# EasyEDA schematic 1-Schematic_IoT Board.json
TITLE: Sheet_1; REV: 1.0; Date: 2025-12-24; Sheet: 1/1; Drawn By: nyaigoti; Company: Your Company
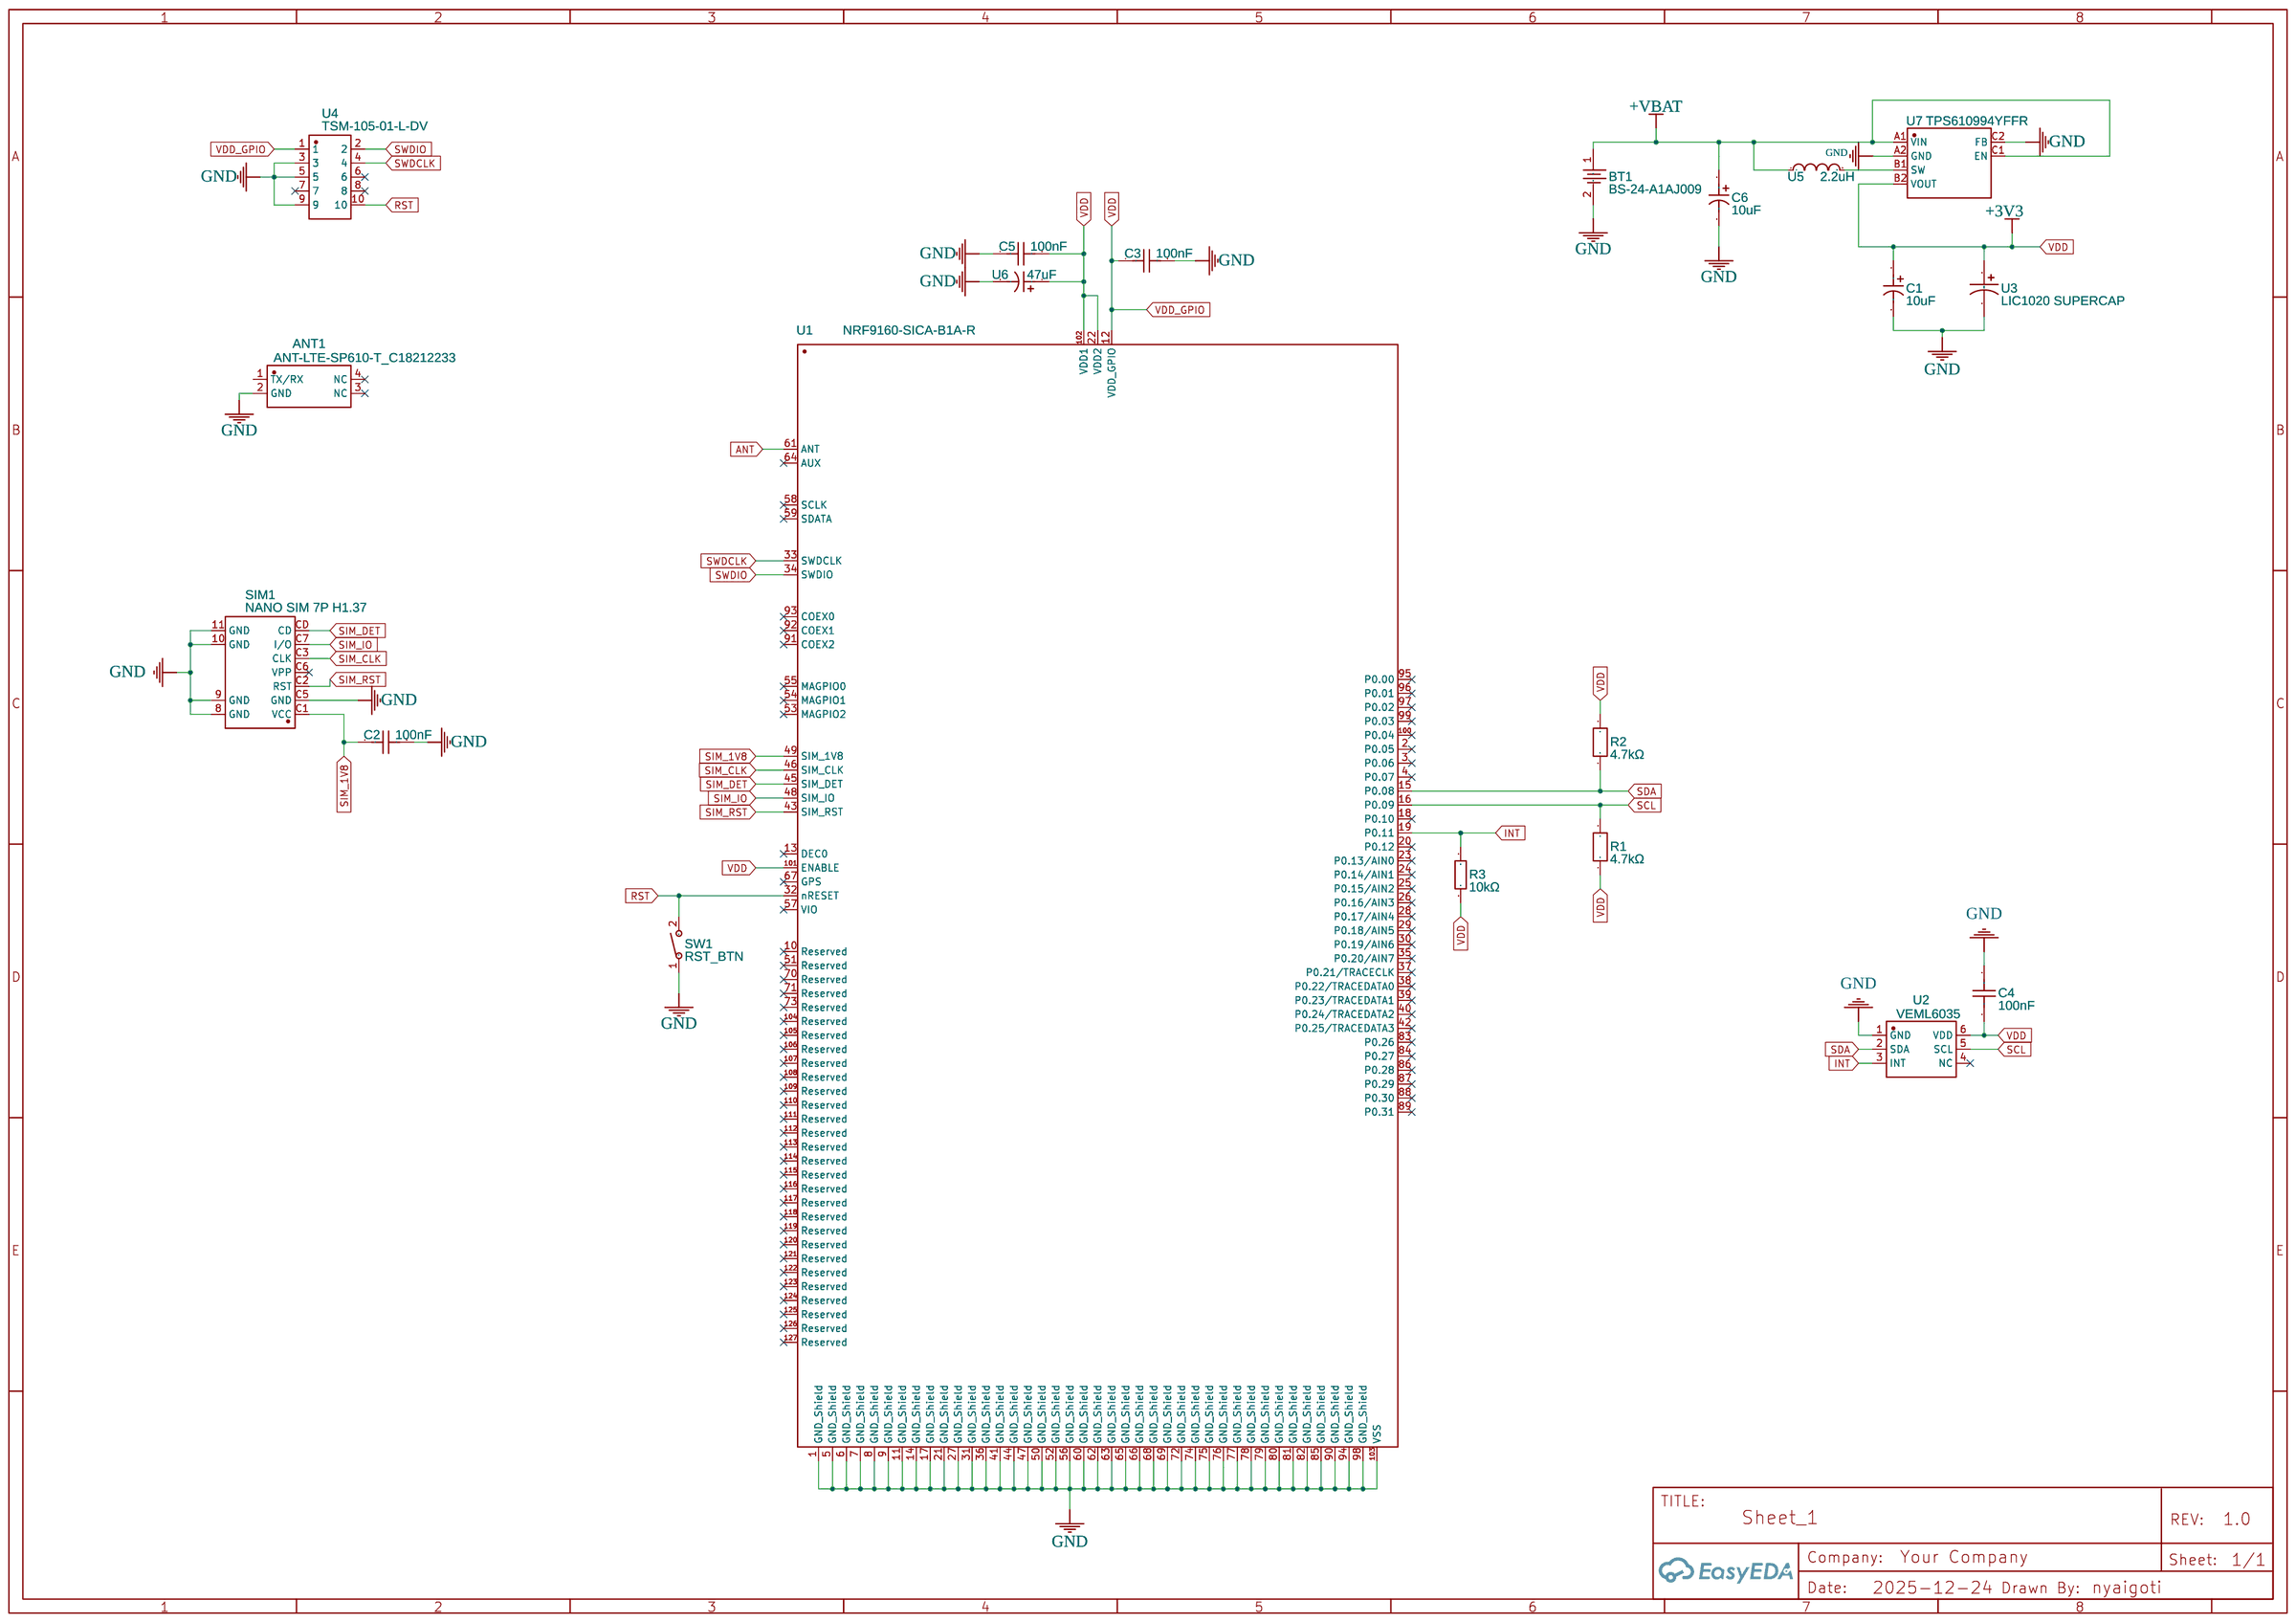
[diagram p0: schematic sheet]

## Parts
ANT1  ANT-LTE-SP610-T_C18212233  [ANT-SMD_ANT-LTE-SP610-T_C18212233]
BT1  BS-24-A1AJ009  [BAT-TH_CR2477-2]
C1  10uF  [CAP-SMD_L3.5-W2.8-FD]
C2  100nF  [C0603]
C3  100nF  [C0603]
C4  100nF  [C0603]
C5  100nF  [C0603]
C6  10uF  [CAP-SMD_L3.5-W2.8-FD]
R1  4.7kΩ  [R0603]
R2  4.7kΩ  [R0603]
R3  10kΩ  [R0603]
SIM1  NANO SIM 7P H1.37  [SIM-SMD_NANO-SIM-7P-H1.37]
SW1  RST_BTN  [KEY-SMD_L4.0-W3.0-LS4.9-1]
U1  NRF9160-SICA-B1A-R  [LGA-127_L16.0-W10.5-P0.50-TL_NRF9160]
U2  VEML6035  [SMD-6_L2.0-W2.0-P0.65-BL]
U3  LIC1020 SUPERCAP  [CAP-TH_BD10.0-P5.00-D1.0-FD]
U4  TSM-105-01-L-DV  [CONN-SMD_10P-P2.54_TSM-105-01-F-DV]
U5  2.2uH  [IND-SMD_L2.5-W2.0_YXMBL252010P]
U6  47uF  [CAP-SMD_BD6.3-L6.6-W6.6-LS7.2-FD-1]
U7  TPS610994YFFR  [DSBGA-6_L1.2-W0.9-R3-C2-P0.40-BL]

## Library data of the parts
ANT1 = ANT-LTE-SP610-T_C18212233: Supplier: LCSC; Supplier Part: C18212233; Manufacturer: TE Connectivity(泰科电子); Manufacturer Part: ANT-LTE-SP610-T; JLCPCB Part Class: Extended Part; Contributor: lcsc
BT1 = BS-24-A1AJ009: Contributor: LCSC; Supplier: LCSC; Supplier Part: C964816; Manufacturer: MYOUNG(美阳); JLCPCB Part Class: Extended Part
C1 C6 = 293D106X9016B2TE3: Supplier: LCSC; Supplier Part: C1953054; Manufacturer: VISHAY(威世); JLCPCB Part Class: Extended Part; Contributor: lcsc
C2-C5 = FCC0603B104K500CT: Supplier: LCSC; Supplier Part: C5137636; Manufacturer: FOJAN(富捷); JLCPCB Part Class: Extended Part; Contributor: lcsc
R1 R2 = CR0603F4K70P05Z: Contributor: LCSC; Supplier: LCSC; Supplier Part: C881083; Manufacturer: EVER OHMS(天二科技); JLCPCB Part Class: Extended Part
R3 = TR0603B10KP05250.1W: Contributor: LCSC; Supplier: LCSC; Supplier Part: C188363; Manufacturer: EVER OHMS(天二科技); Manufacturer Part: TR0603B10K0P0525Z; JLCPCB Part Class: Extended Part
SIM1 = NANO SIM 7P H1.37: Supplier: LCSC; Supplier Part: C7529384; Manufacturer: SHOU HAN(首韩); Contributor: lcsc; JLCPCB Part Class: Extended Part
SW1 = HX 3X4X2-2P-1.6N TACTILE SWITCH: Supplier: LCSC; Supplier Part: C49234124; Manufacturer: hanxia(韩下); Manufacturer Part: HX 3x4x2-2P-1.6N TACTILE SWITCH; JLCPCB Part Class: Extended Part; Contributor: lcsc
U1 = NRF9160-SICA-B1A-R: Supplier: LCSC; Supplier Part: C1518973; Manufacturer: NORDIC; JLCPCB Part Class: Extended Part; Contributor: lcsc
U2 = VEML6035: Contributor: LCSC; Supplier: LCSC; Supplier Part: C2655158; Manufacturer: VISHAY(威世); JLCPCB Part Class: Extended Part
U3 = LIC1020N3R8C080: Supplier: LCSC; Supplier Part: C2901332; Manufacturer: KNSCHA(科尼盛); JLCPCB Part Class: Extended Part; Contributor: lcsc
U4 = TSM-105-01-L-DV: Supplier: LCSC; Supplier Part: C5804070; Manufacturer: SAMTEC; JLCPCB Part Class: Extended Part; Contributor: lcsc
U5 = APH252010T2R2M: Contributor: lcsc; Supplier: LCSC; Supplier Part: C5349606; Manufacturer: APV(爱普微); JLCPCB Part Class: Extended Part
U6 = EMLA500ARA470MF80G: Supplier: LCSC; Supplier Part: C2972709; Manufacturer: NCC(日本贵弥功); JLCPCB Part Class: Extended Part; Contributor: lcsc
U7 = TPS610994YFFR: Contributor: lcsc; Supplier: LCSC; Supplier Part: C2650335; Manufacturer: TI(德州仪器); JLCPCB Part Class: Extended Part

## Nets
+3V3: C1.1 C3.1 C4.2 C5.2 R1.1 R2.1 R3.1 U1.12(VDD_GPIO) U1.22(VDD2) U1.101(ENABLE) U1.102(VDD1) U2.6(VDD) U3.1 U4.1 U6.1 U7.B2(VOUT)
+VBAT: BT1.1 C6.1 U5.1 U7.A1(VIN) U7.C1(EN)
GND: ANT1.2(GND) BT1.2 C1.2 C2.2 C3.2 C4.1 C5.1 C6.2 SIM1.8(GND) SIM1.9(GND) SIM1.10(GND) SIM1.11(GND) SIM1.C5(GND) SW1.1 U1.1(GND_Shield) U1.5(GND_Shield) U1.6(GND_Shield) U1.7(GND_Shield) U1.8(GND_Shield) U1.9(GND_Shield) U1.11(GND_Shield) U1.14(GND_Shield) U1.17(GND_Shield) U1.21(GND_Shield) U1.27(GND_Shield) U1.31(GND_Shield) U1.36(GND_Shield) U1.41(GND_Shield) U1.44(GND_Shield) U1.47(GND_Shield) U1.50(GND_Shield) U1.52(GND_Shield) U1.56(GND_Shield) U1.60(GND_Shield) U1.62(GND_Shield) U1.63(GND_Shield) U1.65(GND_Shield) U1.66(GND_Shield) U1.68(GND_Shield) U1.69(GND_Shield) U1.72(GND_Shield) U1.74(GND_Shield) U1.75(GND_Shield) U1.76(GND_Shield) U1.77(GND_Shield) U1.78(GND_Shield) U1.79(GND_Shield) U1.80(GND_Shield) U1.81(GND_Shield) U1.82(GND_Shield) U1.85(GND_Shield) U1.90(GND_Shield) U1.94(GND_Shield) U1.98(GND_Shield) U1.103(VSS) U2.1(GND) U3.2 U4.3 U4.5 U4.9 U6.2 U7.A2(GND) U7.C2(FB)
ANT: U1.61(ANT)
INT: R3.2 U1.19(P0.11) U2.3(INT)
RST: SW1.2 U1.32(nRESET) U4.10
SCL: R1.2 U1.16(P0.09) U2.5(SCL)
SDA: R2.2 U1.15(P0.08) U2.2(SDA)
SIM_1V8: C2.1 SIM1.C1(VCC) U1.49(SIM_1V8)
SIM_CLK: SIM1.C3(CLK) U1.46(SIM_CLK)
SIM_DET: SIM1.CD U1.45(SIM_DET)
SIM_IO: SIM1.C7(I/O) U1.48(SIM_IO)
SIM_RST: SIM1.C2(RST) U1.43(SIM_RST)
SWDCLK: U1.33(SWDCLK) U4.4
SWDIO: U1.34(SWDIO) U4.2
Net-(U5-2): U5.2 U7.B1(SW)

Not connected (* = marked no-connect by the designer): ANT1 1(TX/RX) 3(NC)* 4(NC)*; SIM1 C6(VPP)*; U1 2(P0.05)* 3(P0.06)* 4(P0.07)* 10(Reserved)* 13(DEC0)* 18(P0.10)* 20(P0.12)* 23(P0.13/AIN0)* 24(P0.14/AIN1)* 25(P0.15/AIN2)* 26(P0.16/AIN3)* 28(P0.17/AIN4)* 29(P0.18/AIN5)* 30(P0.19/AIN6)* 35(P0.20/AIN7)* 37(P0.21/TRACECLK)* 38(P0.22/TRACEDATA0)* 39(P0.23/TRACEDATA1)* 40(P0.24/TRACEDATA2)* 42(P0.25/TRACEDATA3)* 51(Reserved)* 53(MAGPIO2)* 54(MAGPIO1)* 55(MAGPIO0)* 57(VIO)* 58(SCLK)* 59(SDATA)* 64(AUX)* 67(GPS)* 70(Reserved)* 71(Reserved)* 73(Reserved)* 83(P0.26)* 84(P0.27)* 86(P0.28)* 87(P0.29)* 88(P0.30)* 89(P0.31)* 91(COEX2)* 92(COEX1)* 93(COEX0)* 95(P0.00)* 96(P0.01)* 97(P0.02)* 99(P0.03)* 100(P0.04)* 104(Reserved)* 105(Reserved)* 106(Reserved)* 107(Reserved)* 108(Reserved)* 109(Reserved)* 110(Reserved)* 111(Reserved)* 112(Reserved)* 113(Reserved)* 114(Reserved)* 115(Reserved)* 116(Reserved)* 117(Reserved)* 118(Reserved)* 119(Reserved)* 120(Reserved)* 121(Reserved)* 122(Reserved)* 123(Reserved)* 124(Reserved)* 125(Reserved)* 126(Reserved)* 127(Reserved)*; U2 4(NC)*; U4 6* 7* 8*
